# EAGLE design mouse (EAGLE 9.5.2)

## Sheet 1 of 2: Control
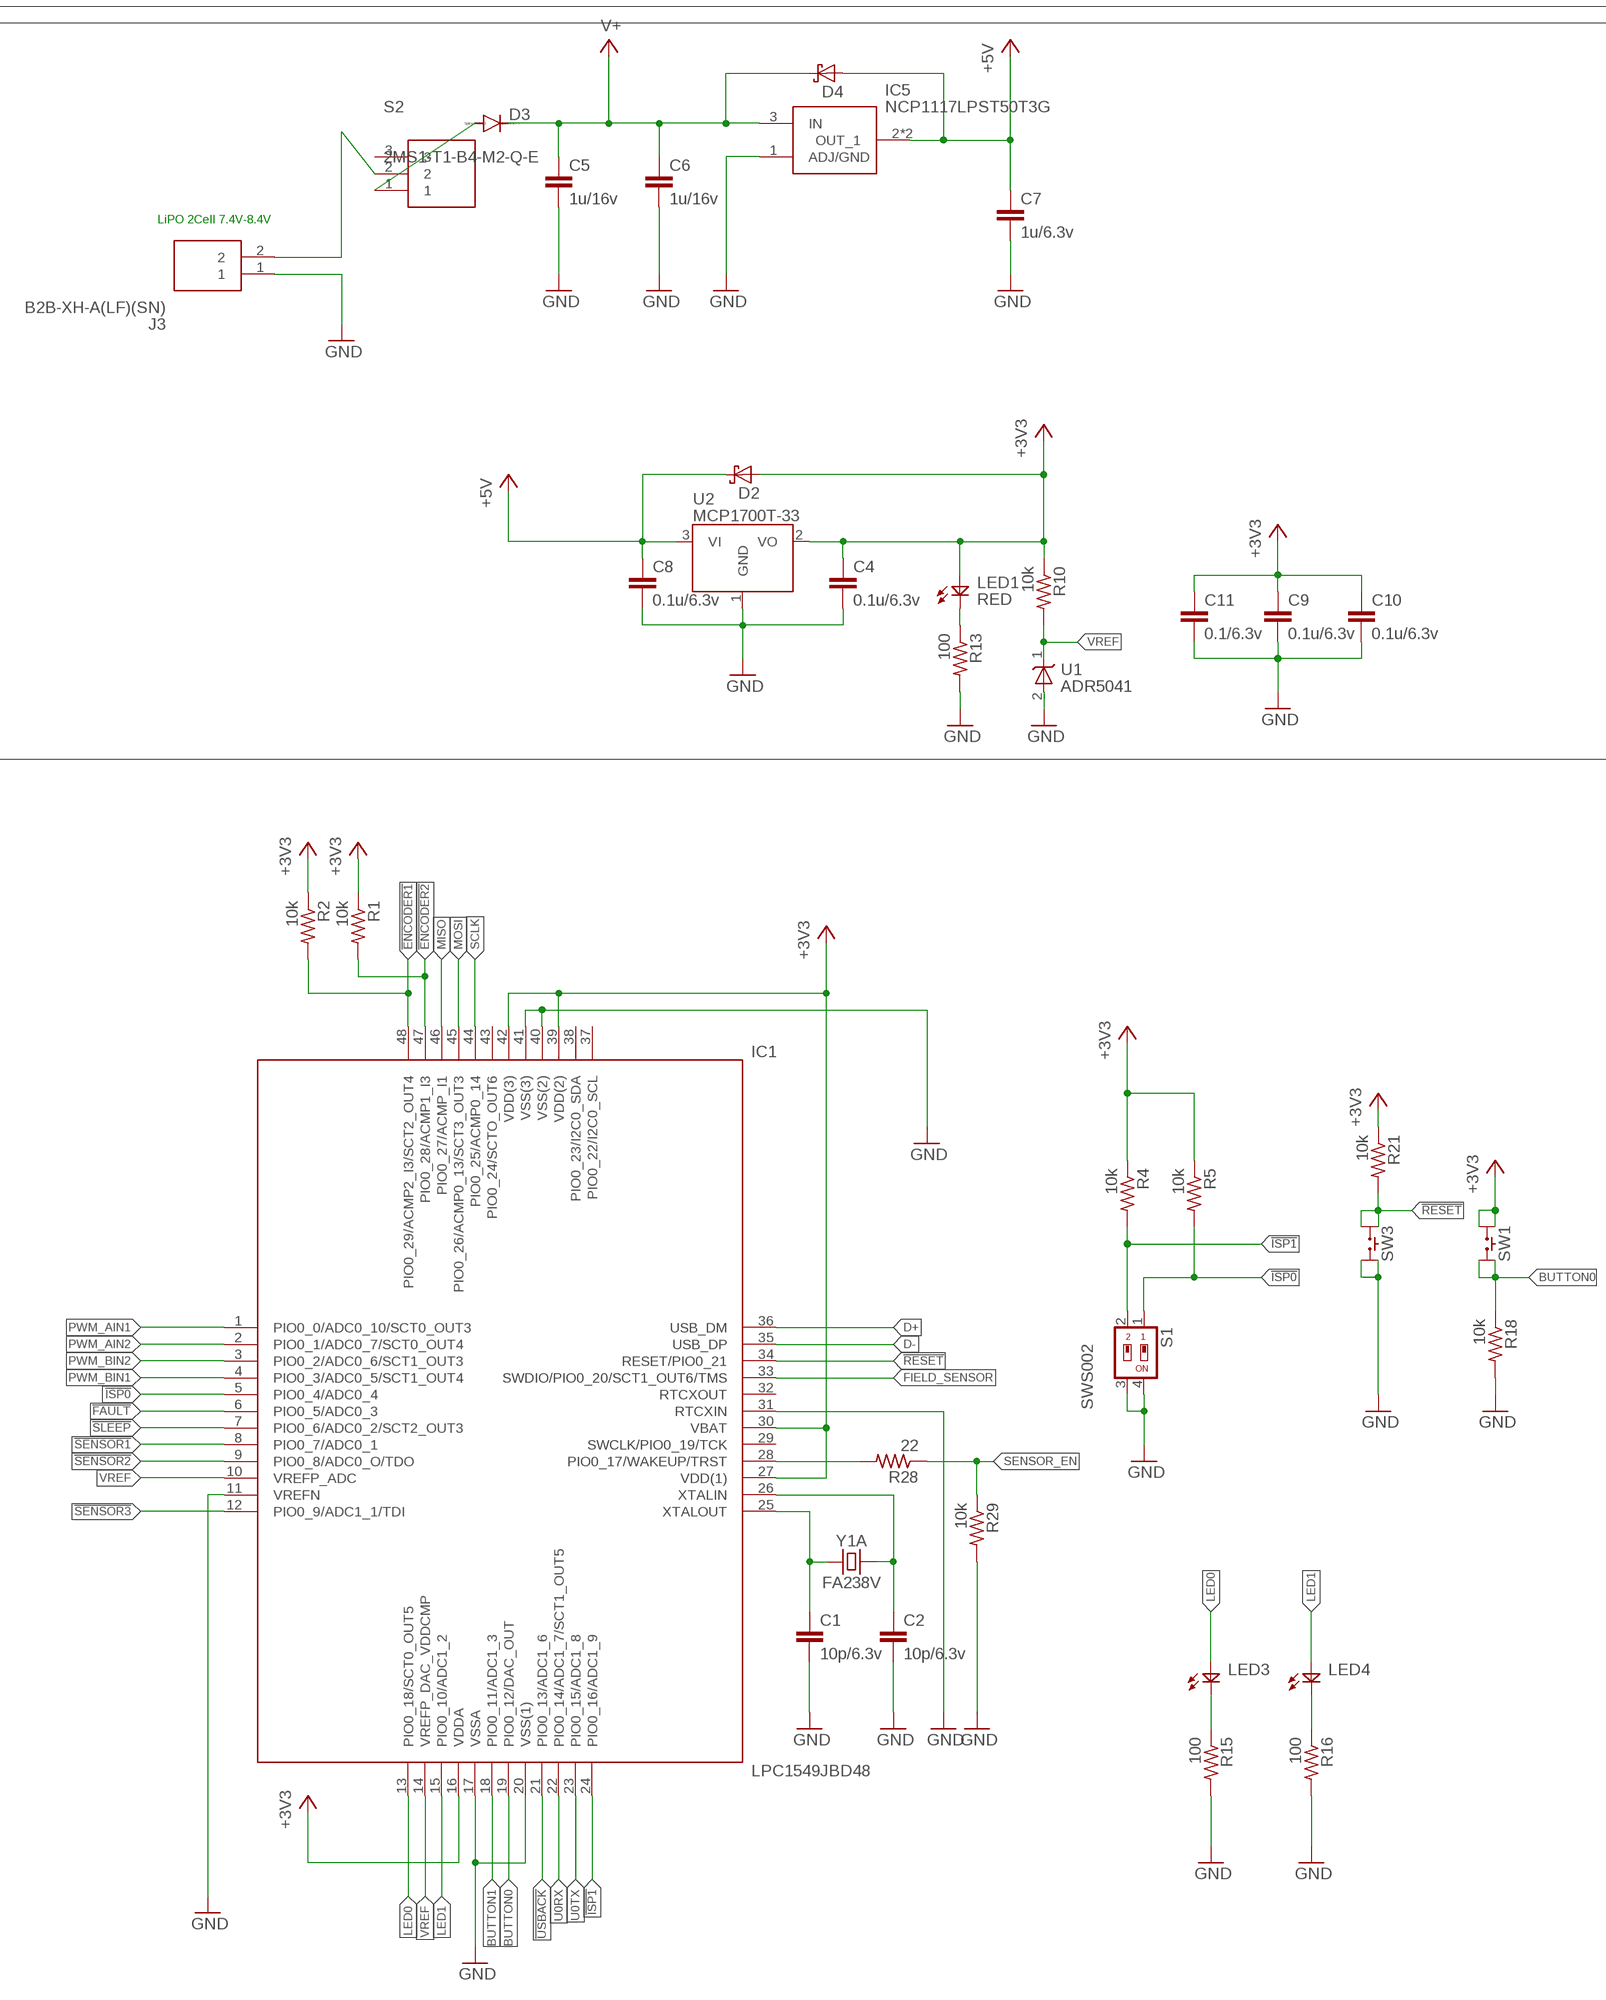
[diagram p0: schematic, sheet 1, part 1 of 2]
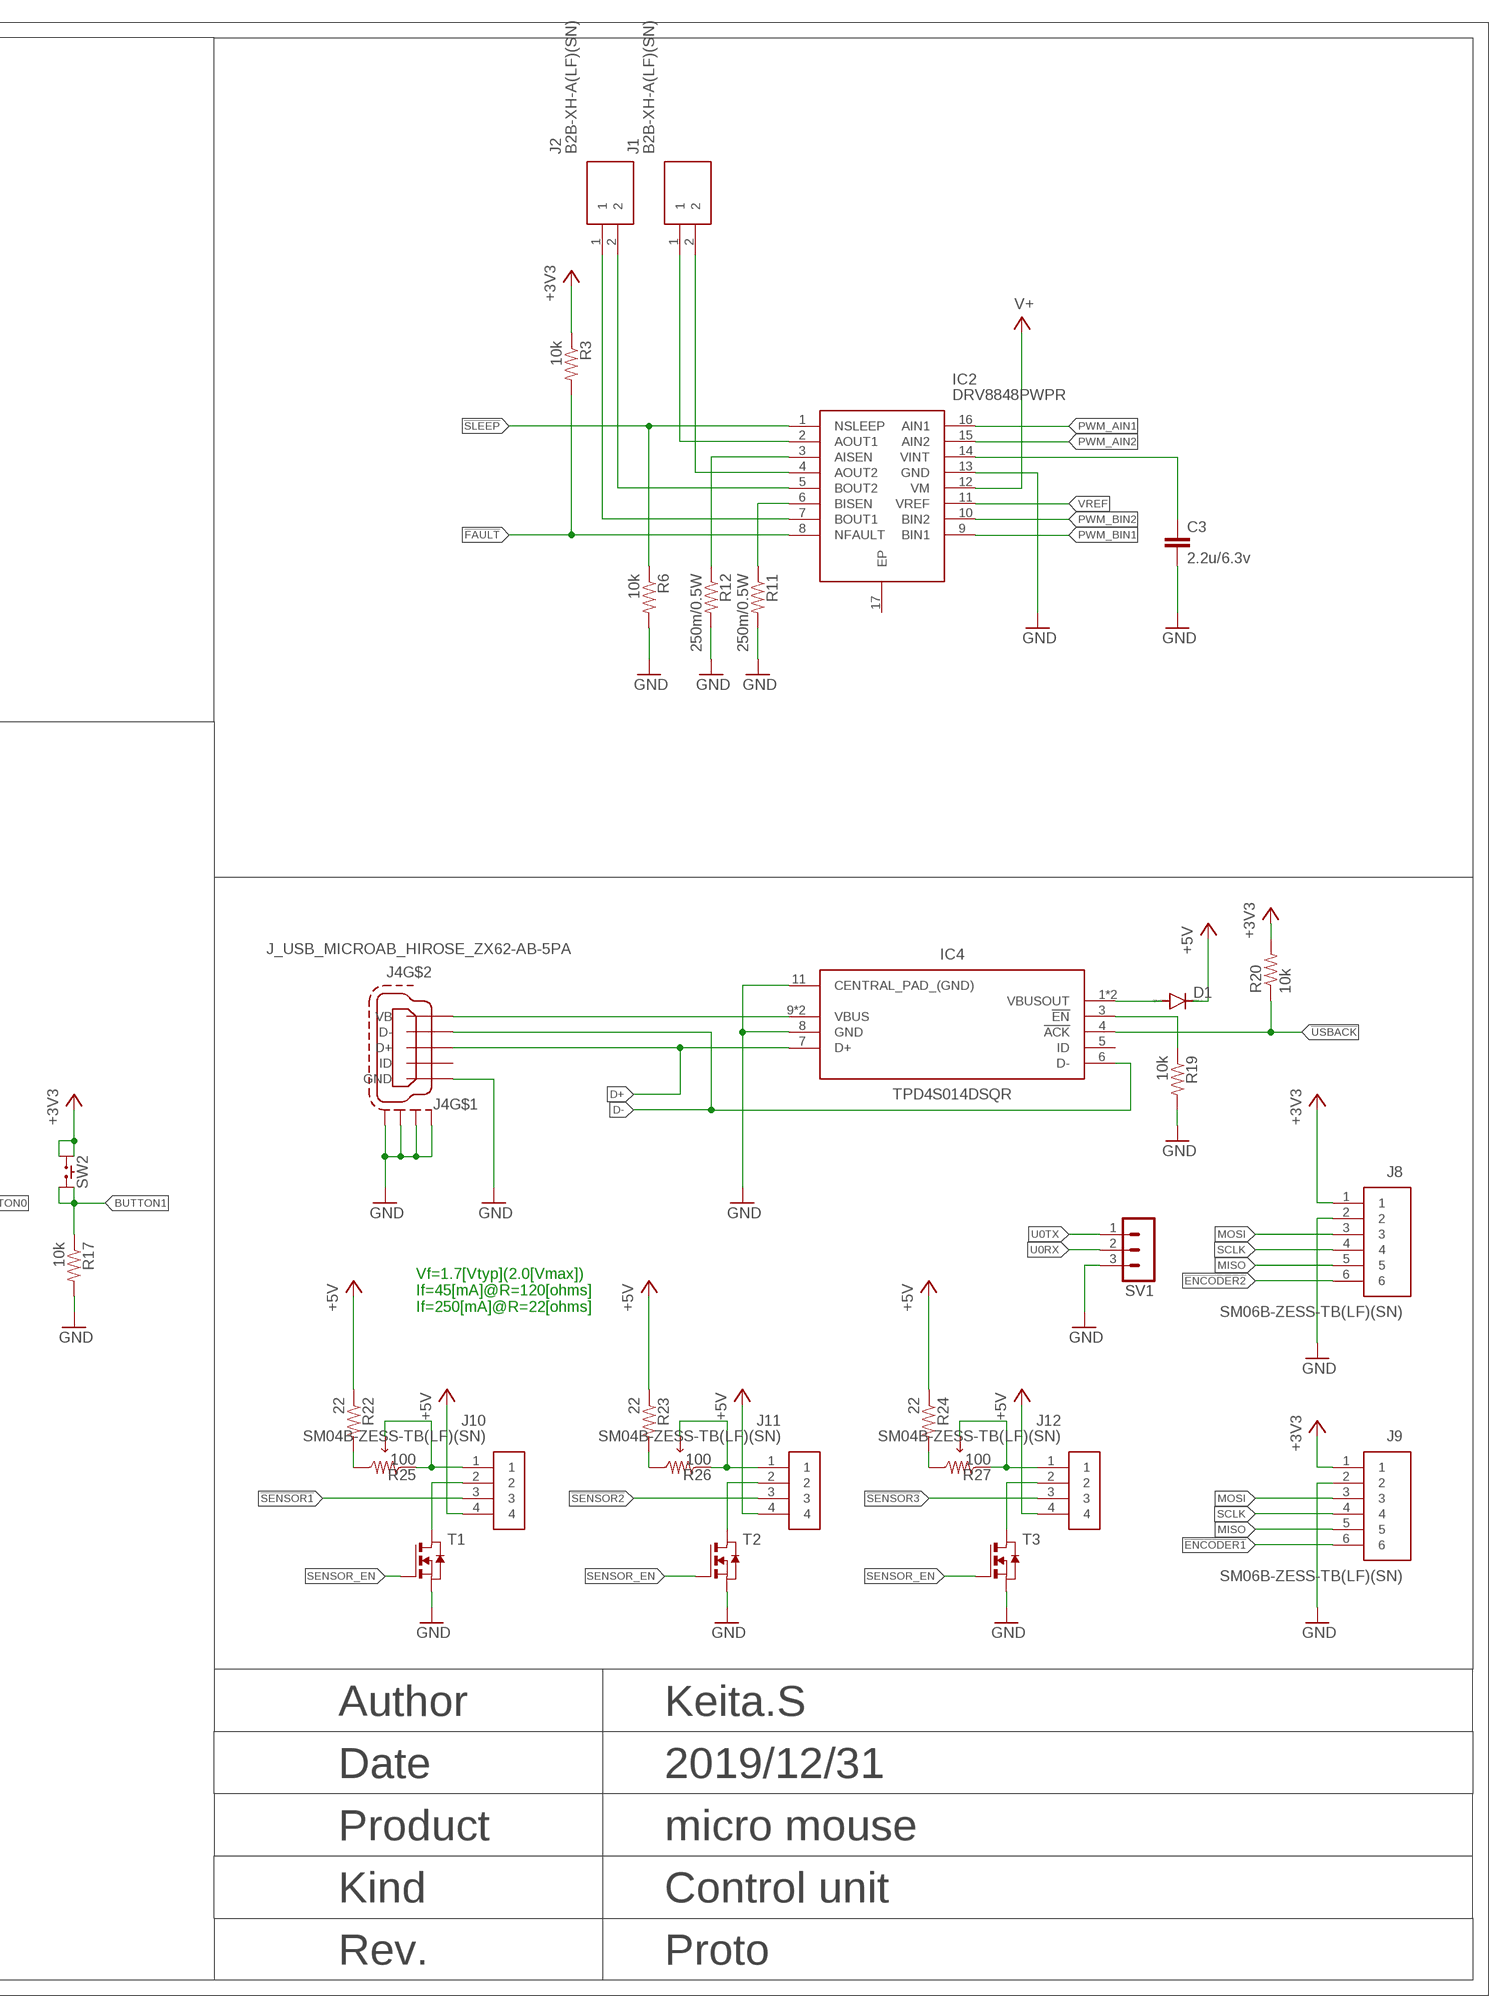
[diagram p1: schematic, sheet 1, part 2 of 2]

### Parts
C1  10p/6.3v  C-EUC0603  [C0603]
C2  10p/6.3v  C-EUC0603  [C0603]
C3  2.2u/6.3v  C-EUC0603  [C0603]
C4  0.1u/6.3v  C-EUC0603  [C0603]
C5  1u/16v  C-EUC0603  [C0603]
C6  1u/16v  C-EUC0603  [C0603]
C7  1u/6.3v  C-EUC0603  [C0603]
C8  0.1u/6.3v  C-EUC0603  [C0603]
C9  0.1u/6.3v  C-EUC0603  [C0603]
C10  0.1u/6.3v  C-EUC0603  [C0603]
C11  0.1/6.3v  C-EUC0603  [C0603]
D1  DIODE-SMB  [SMB]
D2  SBD-SOD523  [DIODE_SOD523]
D3  DIODE-SMB  [SMB]
D4  SBD-SOD523  [DIODE_SOD523]
IC1  LPC1549JBD48  [QFP50P900X900X160-48N]
IC2  DRV8848PWPR  [SOP65P640X120-17N]
IC4  TPD4S014DSQR  [SON40P200X200X80-11N]
IC5  NCP1117LPST50T3G  [SOT230P700X180-4N]
J1  B2B-XH-A(LF)(SN)  [SHDR2W64P0X250_1X2_740X575X700]
J2  B2B-XH-A(LF)(SN)  [SHDR2W64P0X250_1X2_740X575X700]
J3  B2B-XH-A(LF)(SN)  [SHDR2W64P0X250_1X2_740X575X700]
J4  J_USB_MICROAB_HIROSE_ZX62-AB-5PA  [J_USB_MICROAB_HIROSE_ZX62-AB-5PA]
J8  SM06B-ZESS-TB(LF)(SN)  [SM06BZESSTBLFSN]
J9  SM06B-ZESS-TB(LF)(SN)  [SM06BZESSTBLFSN]
J10  SM04B-ZESS-TB(LF)(SN)  [SM04BZESSTBLFSN]
J11  SM04B-ZESS-TB(LF)(SN)  [SM04BZESSTBLFSN]
J12  SM04B-ZESS-TB(LF)(SN)  [SM04BZESSTBLFSN]
LED1  RED  LED1608  [LED1608]
LED3  LED1608  [LED1608]
LED4  LED1608  [LED1608]
R1  10k  R-US_R0603  [R0603]
R2  10k  R-US_R0603  [R0603]
R3  10k  R-US_R0603  [R0603]
R4  10k  R-US_R0603  [R0603]
R5  10k  R-US_R0603  [R0603]
R6  10k  R-US_R0603  [R0603]
R10  10k  R-US_R0603  [R0603]
R11  250m/0.5W  R-US_R1206  [R1206]
R12  250m/0.5W  R-US_R1206  [R1206]
R13  100  R-US_R0603  [R0603]
R15  100  R-US_R0603  [R0603]
R16  100  R-US_R0603  [R0603]
R17  10k  R-US_R0603  [R0603]
R18  10k  R-US_R0603  [R0603]
R19  10k  R-US_R0603  [R0603]
R20  10k  R-US_R0603  [R0603]
R21  10k  R-US_R0603  [R0603]
R22  22  R-US_R0603  [R0603]
R23  22  R-US_R0603  [R0603]
R24  22  R-US_R0603  [R0603]
R25  100  CT6EP203  [CT6EP203]
R26  100  CT6EP203  [CT6EP203]
R27  100  CT6EP203  [CT6EP203]
R28  22  R-US_R0603  [R0603]
R29  10k  R-US_R0603  [R0603]
S1  SWS002  [SMS-002]
S2  2MS1-T1-B4-M2-Q-E  [2MS1-T1-B4-M2-Q-E]
SV1  MA03-1  [MA03-1]
SW1  SKRP  [SKRP]
SW2  SKRP  [SKRP]
SW3  SKRP  [SKRP]
T1  NMOSSOT23  [SOT-23]
T2  NMOSSOT23  [SOT-23]
T3  NMOSSOT23  [SOT-23]
U1  ADR5041  [SC70-3]
U2  MCP1700T-33  [SOT23-3]
Y1  FA238V  [EPSON_FA238V]

### Nets
!ENCODER1: IC1.48(PIO0_29/ACMP2_I3/SCT2_OUT4) J9.6 R2.2
!ENCODER2: IC1.47(PIO0_28/ACMP1_I3) J8.6 R1.2
!FAULT: IC1.6(PIO0_5/ADC0_3) IC2.8(NFAULT) R3.2
!ISP0: IC1.5(PIO0_4/ADC0_4) R5.2 S1.1
!ISP1: IC1.24(PIO0_16/ADC1_9) R4.2 S1.2
!RESET: IC1.34(RESET/PIO0_21) R21.2 SW3.A1 SW3.A2
!SENSOR1: IC1.8(PIO0_7/ADC0_1) J10.3
!SENSOR2: IC1.9(PIO0_8/ADC0_O/TDO) J11.3
!SENSOR3: IC1.12(PIO0_9/ADC1_1/TDI) J12.3
!SLEEP: IC1.7(PIO0_6/ADC0_2/SCT2_OUT3) IC2.1(NSLEEP) R6.1
!USBACK: IC1.21(PIO0_13/ADC1_6) IC4.4(!ACK) R20.1
+3V3: C4.1 C9.1 C10.1 C11.1 D2.A IC1.16(VDDA) IC1.27(VDD(1)) IC1.30(VBAT) IC1.39(VDD(2)) IC1.42(VDD(3)) J8.1 J9.1 LED1.A R1.1 R2.1 R3.1 R4.1 R5.1 R10.1 R20.2 R21.1 SW1.A1 SW1.A2 SW2.A1 SW2.A2 U2.2(VO)
+5V: C7.1 C8.1 D1.C D2.K D4.A IC5.2(OUT_1) IC5.4(OUT_1) J10.4 J11.4 J12.4 R22.1 R23.1 R24.1 U2.3(VI)
BUTTON0: IC1.19(PIO0_12/DAC_OUT) R18.1 SW1.B1 SW1.B2
BUTTON1: IC1.18(PIO0_11/ADC1_3) R17.1 SW2.B1 SW2.B2
D+: IC1.36(USB_DM) IC4.7(D+) J4.P$3(D+)
D-: IC1.35(USB_DP) IC4.6(D-) J4.P$2(D-)
FIELD_SENSOR: IC1.33(SWDIO/PIO0_20/SCT1_OUT6/TMS)
GND: C1.2 C2.2 C3.2 C4.2 C5.2 C6.2 C7.2 C8.2 C9.2 C10.2 C11.2 IC1.11(VREFN) IC1.17(VSSA) IC1.20(VSS(1)) IC1.31(RTCXIN) IC1.40(VSS(2)) IC1.41(VSS(3)) IC2.13(GND) IC4.8(GND) IC4.11(CENTRAL_PAD_(GND)) IC5.1(ADJ/GND) J3.1 J4.P$5(GND) J4.SHIELD1(S1) J4.SHIELD2(S2) J4.SHIELD3(S3) J4.SHIELD4(S4) J8.2 J9.2 R6.2 R11.2 R12.2 R13.2 R15.2 R16.2 R17.2 R18.2 R19.2 R29.2 S1.3 S1.4 SV1.3 SW3.B1 SW3.B2 T1.2(S) T2.2(S) T3.2(S) U1.2(A) U2.1(GND)
LED0: IC1.13(PIO0_18/SCT0_OUT5) LED3.A
LED1: IC1.15(PIO0_10/ADC1_2) LED4.A
MISO: IC1.46(PIO0_27/ACMP_I1) J8.5 J9.5
MOSI: IC1.45(PIO0_26/ACMP0_13/SCT3_OUT3) J8.3 J9.3
N$1: C1.1 IC1.25(XTALOUT) Y1.1
N$2: C2.1 IC1.26(XTALIN) Y1.3
N$3: D3.A S2.1
N$4: R22.2 R25.1(CCW)
N$5: IC2.6(BISEN) R11.1
N$6: D1.A IC4.1(VBUSOUT) IC4.2(VBUSOUT)
N$8: C3.1 IC2.14(VINT)
N$9: J3.2 S2.2
N$10: LED1.K R13.1
N$11: IC2.2(AOUT1) J1.1
N$12: IC2.4(AOUT2) J1.2
N$13: IC2.5(BOUT2) J2.2
N$14: IC2.7(BOUT1) J2.1
N$15: IC2.3(AISEN) R12.1
N$19: LED3.K R15.1
N$20: IC4.3(!EN) R19.1
N$21: LED4.K R16.1
N$22: R23.2 R26.1(CCW)
N$23: IC4.9(VBUS) IC4.10(VBUS) J4.P$1(VB)
N$24: J11.1 R26.2(WIPER) R26.3(CW)
N$25: R24.2 R27.1(CCW)
N$26: J12.1 R27.2(WIPER) R27.3(CW)
N$29: IC1.28(PIO0_17/WAKEUP/TRST) R28.2
N$30: J10.2 T1.1(D)
N$31: J10.1 R25.2(WIPER) R25.3(CW)
N$32: J11.2 T2.1(D)
N$33: J12.2 T3.1(D)
PWM_AIN1: IC1.1(PIO0_0/ADC0_10/SCT0_OUT3) IC2.16(AIN1)
PWM_AIN2: IC1.2(PIO0_1/ADC0_7/SCT0_OUT4) IC2.15(AIN2)
PWM_BIN1: IC1.4(PIO0_3/ADC0_5/SCT1_OUT4) IC2.9(BIN1)
PWM_BIN2: IC1.3(PIO0_2/ADC0_6/SCT1_OUT3) IC2.10(BIN2)
SCLK: IC1.44(PIO0_25/ACMP0_14) J8.4 J9.4
SENSOR_EN: R28.1 R29.1 T1.3(G) T2.3(G) T3.3(G)
U0RX: IC1.22(PIO0_14/ADC1_7/SCT1_OUT5) SV1.2
U0TX: IC1.23(PIO0_15/ADC1_8) SV1.1
V+: C5.1 C6.1 D3.C D4.K IC2.12(VM) IC5.3(IN)
VREF: IC1.10(VREFP_ADC) IC1.14(VREFP_DAC_VDDCMP) IC2.11(VREF) R10.2 U1.1(K)
Unconnected: IC1.29(SWCLK/PIO0_19/TCK) IC1.32(RTCXOUT) IC1.37(PIO0_22/I2C0_SCL) IC1.38(PIO0_23/I2C0_SDA) IC1.43(PIO0_24/SCTO_OUT6) IC2.17(EP) IC4.5(ID) J4.P$4(ID) S2.3 Y1.2 Y1.4

### Notes on the sheet
- LiPO 2Cell 7.4V-8.4V
- Vf=1.7[Vtyp](2.0[Vmax])
  If=45[mA]@R=120[ohms]
  If=250[mA]@R=22[ohms]
- Author | Keita.S
- Date | 2019/12/31
- Product | micro mouse
- Kind | Control unit
- Rev. | Proto

## Sheet 2 of 2

## Library data of the parts
C1-C11 = rcl:C-EU: CAPACITOR, European symbol; SPICEPREFIX: C
D1 D3 = diode:DIODE-: DIODE
D2 D4 = MotorDriver:SBD-*
IC1 = LPC1549JBD48:LPC1549JBD48: NXP - LPC1549JBD48 - 32BIT MCU, CORTEX-M3, 72 MHZ, LQFP-48 Source: Datasheet <http://www.farnell.com/datasheets/1963077.pdf>; DESCRIPTION: NXP - LPC1549JBD48 - 32BIT MCU, CORTEX-M3, 72 MHZ, LQFP-48; HEIGHT: 1.6mm; MANUFACTURER_NAME: Nexperia; MANUFACTURER_PART_NUMBER: LPC1549JBD48; SUPPLIER_NAME: RS
IC2 = DRV8848PWPR:DRV8848PWPR: Motor / Motion / Ignition Controllers & Drivers 2A Dual H-Bridge 16-HTSSOP -40 to 85 Source: Datasheet <http://www.ti.com/lit/ds/symlink/drv8848.pdf>; DESCRIPTION: Motor / Motion / Ignition Controllers & Drivers 2A Dual H-Bridge 16-HTSSOP -40 to 85; HEIGHT: 1.2mm; MANUFACTURER_NAME: Texas Instruments; MANUFACTURER_PART_NUMBER: DRV8848PWPR
IC4 = TPD4S014DSQR:TPD4S014DSQR: Texas Instruments TPD4S014DSQR, USB Controller, 480Mbit/s, USB 2.0, 10-Pin SON <https://componentsearchengine.com/Images/3/TPD4S014DSQR.jpg> Source: Datasheet <http://www.ti.com/lit/gpn/tpd4s014>; DESCRIPTION: Texas Instruments TPD4S014DSQR, USB Controller, 480Mbit/s, USB 2.0, 10-Pin SON; HEIGHT: 0.8mm; MANUFACTURER_NAME: Texas Instruments; MANUFACTURER_PART_NUMBER: TPD4S014DSQR; RS_PART_NUMBER: 7422968; SUPPLIER_NAME: RS
IC5 = NCP1117LPST50T3G:NCP1117LPST50T3G: Source: Datasheet <http://uk.rs-online.com/web/p/products/7857187P>; ALLIED_NUMBER: 70340553; HEIGHT: 1.8mm; MANUFACTURER_NAME: ON Semiconductor; MANUFACTURER_PART_NUMBER: NCP1117LPST50T3G; RS_PART_NUMBER: 7857187P; RS_PRICE-STOCK: http://uk.rs-online.com/web/p/products/7857187P
J1-J3 = B2B-XH-A(LF)(SN):B2B-XH-A(LF)(SN): JST XH Series, 2.5mm Pitch 2 Way 1 Row Straight PCB Header, Solder Termination, 3A Source: Datasheet <http://uk.rs-online.com/web/p/products/8201554P>; DESCRIPTION: JST XH Series, 2.5mm Pitch 2 Way 1 Row Straight PCB Header, Solder Termination, 3A; HEIGHT: 7mm; MANUFACTURER_NAME: JST (JAPAN SOLDERLESS TERMINALS); MANUFACTURER_PART_NUMBER: B2B-XH-A(LF)(SN); RS_PART_NUMBER: 8201554P; RS_PRICE-STOCK: http://uk.rs-online.com/web/p/products/8201554P
J4 = j_usb_hirose_zx62-ab-5pa:J_USB_MICROAB_HIROSE_ZX62-AB-5PA: USB Micro-AB SMT connector Hirose Electric Co Ltd: ZX62-AB-5P
J8 J9 = SM06B-ZESS-TB(LF)(SN):SM06B-ZESS-TB(LF)(SN): Wire-To-Board Connector, ZE Series, Surface Mount, Header, 6, 1.5 mm, Tin Plated Contacts RoHS Compliant: Yes Source: Datasheet <https://componentsearchengine.com/Datasheets/2/SM06B-ZESS-TB(LF)(SN).pdf>; DESCRIPTION: Wire-To-Board Connector, ZE Series, Surface Mount, Header, 6, 1.5 mm, Tin Plated Contacts RoHS Compliant: Yes; HEIGHT: 5.8mm; MANUFACTURER_NAME: JST (JAPAN SOLDERLESS TERMINALS); MANUFACTURER_PART_NUMBER: SM06B-ZESS-TB(LF)(SN)
J10-J12 = SM04B-ZESS-TB(LF)(SN):SM04B-ZESS-TB(LF)(SN): JST (JAPAN SOLDERLESS TERMINALS) - SM04B-ZESS-TB(LF)(SN) - CONNECTOR, HEADER, 4POS, 1ROW, 1.5MM Source: Datasheet <http://www.jst-mfg.com/product/pdf/eng/eZE.pdf>; DESCRIPTION: JST (JAPAN SOLDERLESS TERMINALS) - SM04B-ZESS-TB(LF)(SN) - CONNECTOR, HEADER, 4POS, 1ROW, 1.5MM; HEIGHT: 5mm; MANUFACTURER_NAME: JST (JAPAN SOLDERLESS TERMINALS); MANUFACTURER_PART_NUMBER: SM04B-ZESS-TB(LF)(SN)
LED1 LED3 LED4 = MotorDriver:LED
R1-R6 R10-R13 R15-R24 R28 R29 = rcl:R-US_: RESISTOR, American symbol; SPICEPREFIX: R
R25-R27 = CT6EP203:CT6EP203: TRIMMER 20K OHM 0.5W PC PIN TOP Source: Datasheet <https://www.nidec-copal-electronics.com/e/catalog/trimmer/ct-6.pdf>; DESCRIPTION: TRIMMER 20K OHM 0.5W PC PIN TOP; HEIGHT: 6.1mm; MANUFACTURER_NAME: Copal Electronics; MANUFACTURER_PART_NUMBER: CT6EP203
S1 = smd-special:SWS002: SMD Dip Switch 2 pol.
S2 = 2MS1-T1-B4-M2-Q-E:2MS1-T1-B4-M2-Q-E: Sub-miniature toggle switch Source: Datasheet <http://akizukidenshi.com/download/2MS1-T1-B4-M2-Q-E-S.pdf>; DESCRIPTION: Sub-miniature toggle switch; HEIGHT: mm; MANUFACTURER_NAME: Cosland; MANUFACTURER_PART_NUMBER: 2MS1-T1-B4-M2-Q-E
SV1 = con-lstb:MA03-1: PIN HEADER; OC_FARNELL: unknown; OC_NEWARK: unknown
SW1-SW3 = MotorDriver:SKRP
T1-T3 = zetex:NMOSSOT23: MOS FET; OC_FARNELL: unknown; OC_NEWARK: unknown
U1 = MotorDriver:ADR504*
U2 = MotorDriver:MCP1700T-*
Y1 = FA238V:FA238V: MHz RANGE CRYSTAL UNIT Source: Datasheet <https://support.epson.biz/td/api/doc_check.php?mode=dl&lang=en&Parts=FA-238V>; DESCRIPTION: MHz RANGE CRYSTAL UNIT; HEIGHT: mm; MANUFACTURER_NAME: Epson ICs; MANUFACTURER_PART_NUMBER: FA238V; SUPPLIER_NAME: RS

## Board
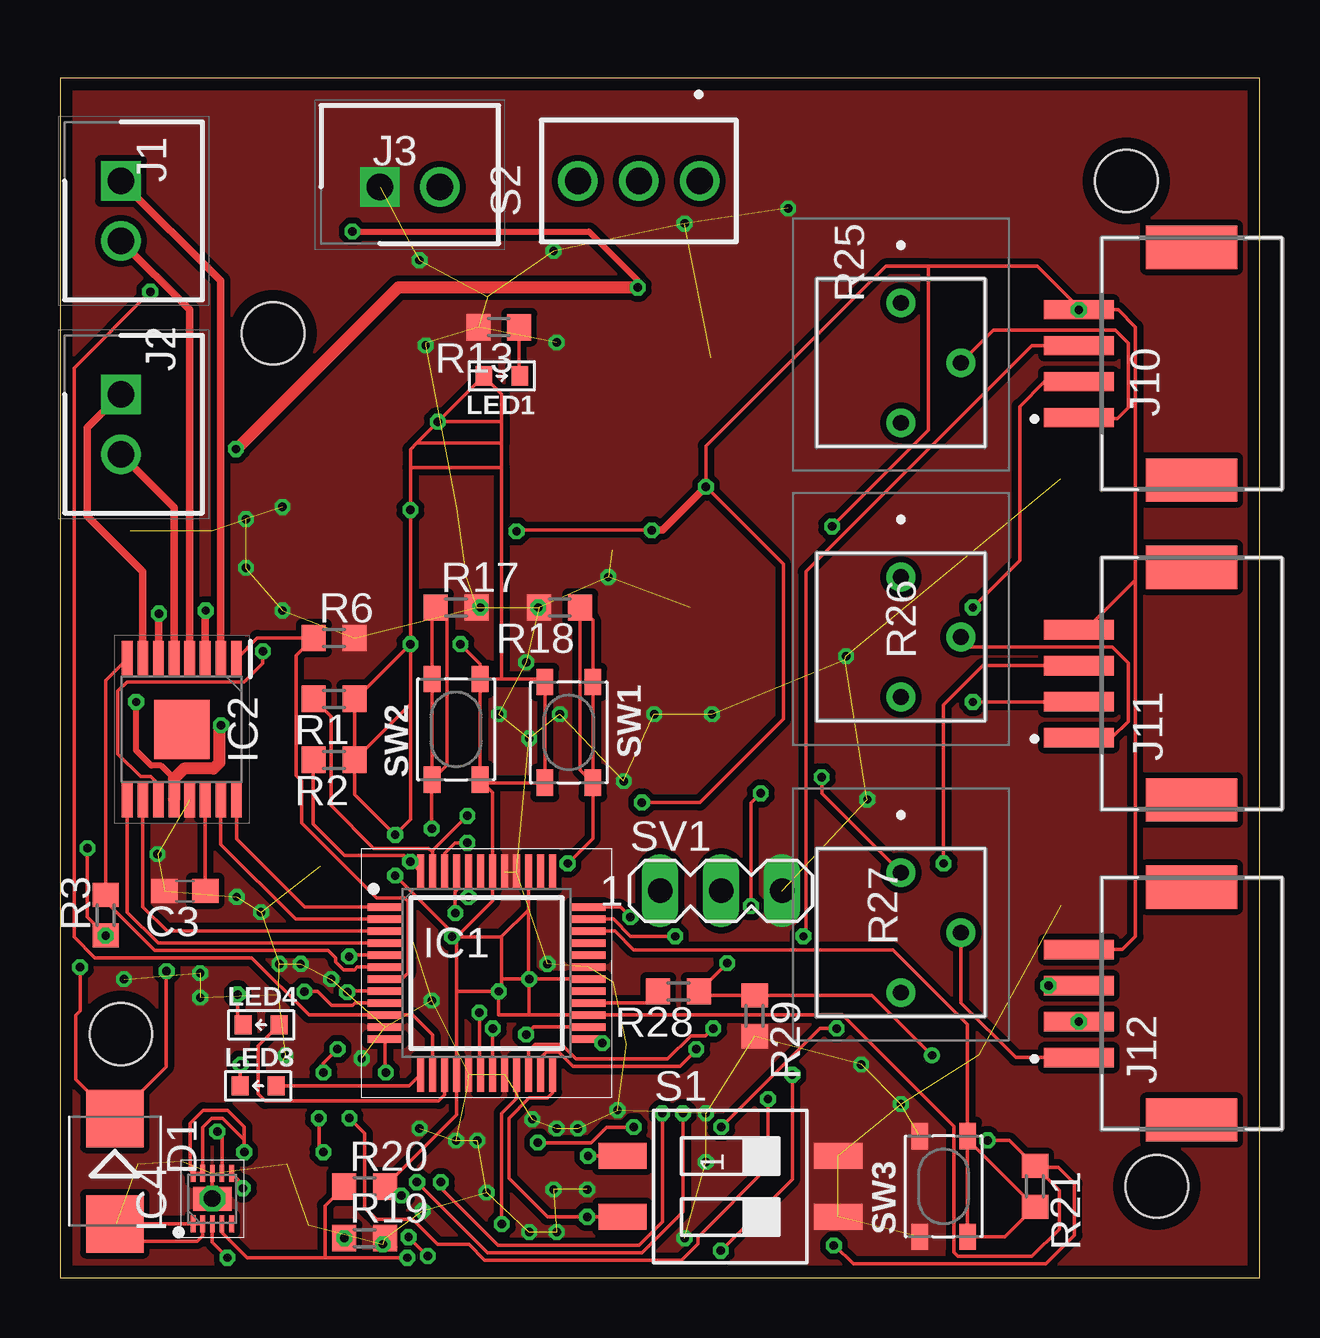
[diagram p2: board, top side]
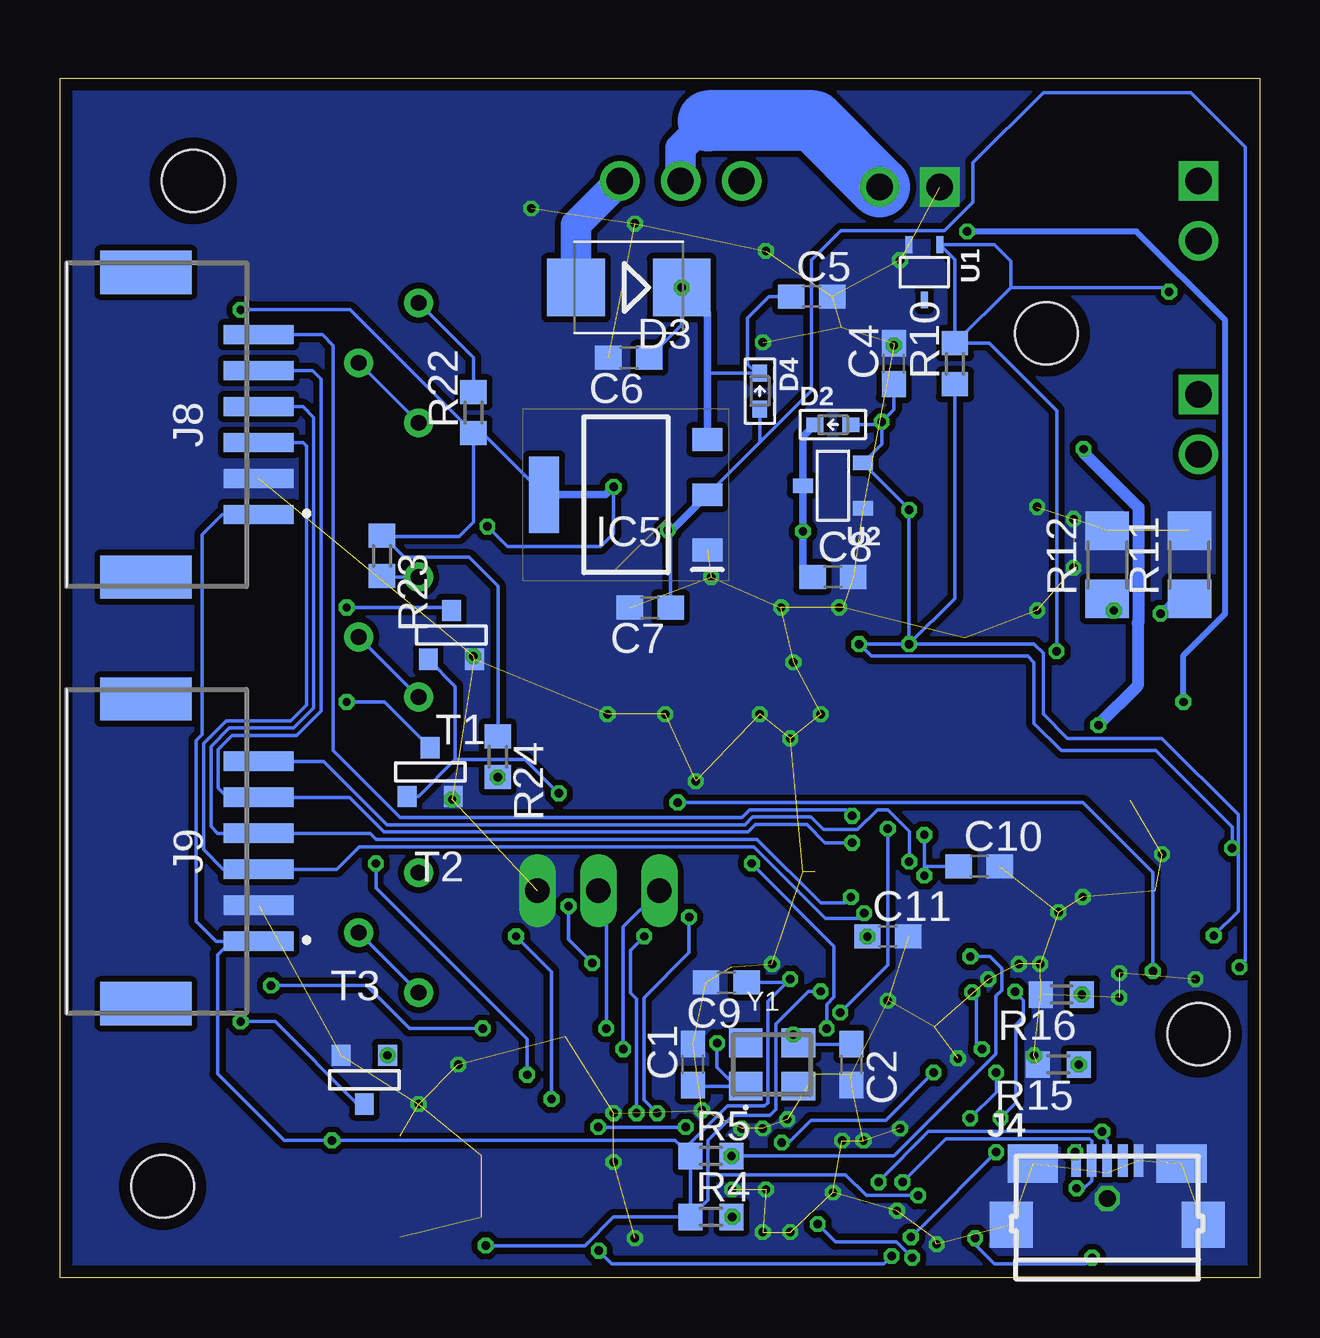
[diagram p3: board, bottom side, seen from below]

Size 50 x 50 mm. Coordinates in mm from the lower left corner, seen from the top.
Outline: 0,0 50,0 50,50 0,50 0,0
Copper layers (1*16): Top 0.035mm / dielectric 1.6mm / Bottom 0.035mm
Design rules "Elecrow_2-layer_PCB_eagle_rule": minimum track width 6mil, minimum drill 12mil, track to track 6mil, track to pad 6mil, pad to pad 6mil, via to via 8mil, smd to smd 0mil, copper to edge 20mil, drill to drill 10mil, minimum pad ring 6mil, minimum via ring 6mil, stop-mask expansion 0mil, vias tented up to drill 100mil, thermal gap 10mil
Holes 2.6 mm at 44.45,45.72 45.72,3.81 8.89,39.37 2.54,10.16

### Footprints (pad centres in the part's own frame; a part is rotated, then mirrored left to right if it is on the bottom)
C0603 = smd 1.1 x 1: 1 -0.85,0; 2 0.85,0
SMB = smd 2.4 x 2.4: A 2.2,0; C -2.2,0
DIODE_SOD523 = smd 0.7 x 0.6: A 0.75,0; K -0.75,0
QFP50P900X900X160-48N = smd 1.45 x 0.3: 1 -4.225,2.75; 2 -4.225,2.25; 3 -4.225,1.75; 4 -4.225,1.25; 5 -4.225,0.75; 6 -4.225,0.25; 7 -4.225,-0.25; 8 -4.225,-0.75; 9 -4.225,-1.25; 10 -4.225,-1.75; 11 -4.225,-2.25; 12 -4.225,-2.75; 25 4.225,-2.75; 26 4.225,-2.25; 27 4.225,-1.75; 28 4.225,-1.25; 29 4.225,-0.75; 30 4.225,-0.25; 31 4.225,0.25; 32 4.225,0.75; 33 4.225,1.25; 34 4.225,1.75; 35 4.225,2.25; 36 4.225,2.75 | smd 0.3 x 1.45: 13 -2.75,-4.225; 14 -2.25,-4.225; 15 -1.75,-4.225; 16 -1.25,-4.225; 17 -0.75,-4.225; 18 -0.25,-4.225; 19 0.25,-4.225; 20 0.75,-4.225; 21 1.25,-4.225; 22 1.75,-4.225; 23 2.25,-4.225; 24 2.75,-4.225; 37 2.75,4.225; 38 2.25,4.225; 39 1.75,4.225; 40 1.25,4.225; 41 0.75,4.225; 42 0.25,4.225; 43 -0.25,4.225; 44 -0.75,4.225; 45 -1.25,4.225; 46 -1.75,4.225; 47 -2.25,4.225; 48 -2.75,4.225
SOP65P640X120-17N = smd 1.475 x 0.45: 1 -2.938,2.275; 2 -2.938,1.625; 3 -2.938,0.975; 4 -2.938,0.325; 5 -2.938,-0.325; 6 -2.938,-0.975; 7 -2.938,-1.625; 8 -2.938,-2.275; 9 2.938,-2.275; 10 2.938,-1.625; 11 2.938,-0.975; 12 2.938,-0.325; 13 2.938,0.325; 14 2.938,0.975; 15 2.938,1.625; 16 2.938,2.275 | smd 2.46 x 2.31: 17 0,0
SON40P200X200X80-11N = smd 0.7 x 0.2: 1 -1.05,0.8; 2 -1.05,0.4; 3 -1.05,0; 4 -1.05,-0.4; 5 -1.05,-0.8; 6 1.05,-0.8; 7 1.05,-0.4; 8 1.05,0; 9 1.05,0.4; 10 1.05,0.8 | smd 1 x 1.6: 11 0,0
SOT230P700X180-4N = smd 1.25 x 0.95: 1 -3.4,2.3; 2 -3.4,0; 3 -3.4,-2.3 | smd 1.25 x 3.2: 4 3.4,0
SHDR2W64P0X250_1X2_740X575X700 = drill 1.1 pad 1.65 square: 1 0,0 | drill 1.1 pad 1.65: 2 2.5,0
J_USB_MICROAB_HIROSE_ZX62-AB-5PA = smd 0.4 x 1.35: P$1 -1.3,4.125; P$2 -0.65,4.125; P$3 0,4.125; P$4 0.65,4.125; P$5 1.3,4.125 | smd 1.8 x 1.9: SHIELD1 -4,1.45; SHIELD4 4,1.45 | smd 2.1 x 1.6: SHIELD2 -3.1,4; SHIELD3 3.1,4
SM06BZESSTBLFSN = smd 0.8 x 2.9: 1 3.75,4; 2 2.25,4; 3 0.75,4; 4 -0.75,4; 5 -2.25,4; 6 -3.75,4 | smd 1.8 x 3.8: MP1 -6.35,-0.7; MP2 6.35,-0.7
SM04BZESSTBLFSN = smd 0.8 x 2.9: 1 -2.25,3.25; 2 -0.75,3.25; 3 0.75,3.25; 4 2.25,3.25 | smd 1.8 x 3.8: 5 -4.85,-1.45; 6 4.85,-1.45
LED1608 = smd 0.7 x 0.8: A 0.75,0; K -0.75,0
R0603 = smd 1 x 1.1: 1 -0.85,0; 2 0.85,0
R1206 = smd 1.6 x 1.803: 1 -1.422,0; 2 1.422,0
CT6EP203 = drill 0.65 pad 1.192: 1 0,0; 2 2.5,2.5; 3 5,0
SMS-002 = smd 1.092 x 2.007: 1 -1.27,-4.496; 2 1.27,-4.496; 3 1.27,4.496; 4 -1.27,4.496
2MS1-T1-B4-M2-Q-E = drill 1.09 pad 1.65: 1 0,-2.54; 2 0,0; 3 0,2.54
MA03-1 = drill 1.016 long: 1 -2.54,0; 2 0,0; 3 2.54,0
SKRP = smd 1.1 x 0.7: A1 -2.1,-1; A2 2.1,-1; B1 -2.1,1; B2 2.1,1
SOT-23 = smd 0.787 x 0.889: 1 0.025,-1.016; 2 -0.94,1.016; 3 0.991,1.016
SC70-3 = smd 0.3 x 0.7: 1 -0.65,-1.15; 2 0.65,-1.15; 3 0,1.15
SOT23-3 = smd 0.6 x 0.85: 1 -0.95,-1.25; 2 0.95,-1.25; 3 0,1.25
EPSON_FA238V = smd 1.4 x 1.2: 1 -1.1,-0.9; 2 1.1,-0.9; 3 1.1,0.9; 4 -1.1,0.9

### Placement (x,y rotation side)
C1  23.62,8.89 90 bottom
C2  17.02,8.89 270 bottom
C3  5.21,16.13 180 top
C4  15.24,38.1 90 bottom
C5  18.67,40.89 0 bottom
C6  26.29,38.35 180 bottom
C7  25.4,27.94 180 bottom
C8  17.78,29.21 0 bottom
C9  22.23,12.32 180 bottom
C10  11.68,17.14 0 bottom
C11  15.49,14.22 0 bottom
D1  2.29,4.45 270 top
D2  17.78,35.56 0 bottom
D3  26.29,41.27 180 bottom
D4  20.83,36.96 270 bottom
IC1  17.78,12.7 0 top
IC2  5.08,22.86 270 top
IC4  6.35,3.3 90 top
IC5  26.42,32.64 180 bottom
J1  2.54,45.72 270 top
J2  2.54,36.83 270 top
J3  13.34,45.47 0 top
J4  6.35,0.76 0 bottom
J8  45.72,35.56 270 bottom
J9  45.72,17.78 270 bottom
J10  45.72,38.1 90 top
J11  45.72,24.77 90 top
J12  45.72,11.43 90 top
LED1  18.41,37.59 180 top
LED3  8.26,8 0 top
LED4  8.38,10.54 0 top
R1  11.43,24.13 180 top
R2  11.43,21.59 180 top
R3  1.91,15.11 90 top
R4  22.86,2.54 0 bottom
R5  22.86,5.08 0 bottom
R6  11.43,26.67 0 top
R10  12.7,38.1 90 bottom
R11  2.92,29.72 90 bottom
R12  6.35,29.72 90 bottom
R13  18.29,39.62 180 top
R15  8.38,8.89 180 bottom
R16  8.26,11.81 180 bottom
R17  16.51,27.94 0 top
R18  20.83,27.94 180 top
R19  12.7,1.65 0 top
R20  12.7,3.81 0 top
R21  40.64,3.81 270 top
R22  32.77,36.07 90 bottom
R23  36.58,30.1 270 bottom
R24  31.75,21.72 270 bottom
R25  35.05,40.64 270 top
R26  35.05,29.21 270 top
R27  35.05,16.89 270 top
R28  25.78,11.94 180 top
R29  28.96,10.92 270 top
S1  27.94,3.81 270 top
S2  24.13,45.72 90 top
SV1  27.56,16.13 0 top
SW1  21.21,22.73 270 top
SW2  16.51,22.86 90 top
SW3  36.83,3.81 90 top
T1  33.66,26.8 180 bottom
T2  34.54,21.08 180 bottom
T3  37.34,8.26 0 bottom
U1  13.97,41.91 180 bottom
U2  17.78,33.02 90 bottom
Y1  20.32,8.89 0 bottom

### Tracks (layer width: path | path; a pad name or v marks a point on that pad's centre or on a via)
!ENCODER1  (via drill 0.35)
  Top 0.152: R2.2 10.54,21.55 10.54,18.93 11.87,17.6 14.35,17.6 IC1.48 v14.6,17.35
  Bottom 0.152: v14.6,17.35 14.6,18.61 15.49,19.51 15.94,19.51 16.76,18.69 18.18,18.69 18.69,19.2 21.13,19.2 21.45,18.88 36.36,18.88 39.01,21.53 J9.6
!ENCODER2  (via drill 0.35)
  Top 0.152: R1.2 11.3,23.41 11.3,22.24 11.31,22.23 11.31,19.68 13.08,17.91 15.37,17.91 15.53,17.74 IC1.47 15.53,17.81 v16.97,19.26
  Bottom 0.152: J8.6 39.06,39.31 38.61,38.86 38.61,21.97 35.83,19.19 21.58,19.19 21.26,19.51 17.23,19.51 v16.97,19.26
!FAULT
  Top 0.152: IC2.8 1.91,24.9 R3.2 1.91,15.7 3.96,13.64 11.19,13.64 11.5,13.34 11.5,13.16 11.82,12.84 12.28,12.84 12.39,12.95 IC1.6
!ISP0  (via drill 0.35)
  Top 0.152: R5.2 S1.1 | v12.05,13.39 12.11,13.45 IC1.5
  Bottom 0.152: R5.2 15.24,5.08 10.99,9.34 10.99,11.75 10.75,11.99 10.75,12.91 11.23,13.39 v12.05,13.39
  other vias: 22.01,5.08
!ISP1  (via drill 0.35)
  Top 0.152: S1.2 v21.97,2.54 20.32,2.54 18.72,4.14 18.72,6.66 19.56,7.49 20.32,7.49 20.53,7.7 IC1.24
  Bottom 0.152: R4.2 v21.97,2.54
!RESET
  Top 0.152: 37.83,5.77 R21.2 39.39,1.71 SW3.A1 37.83,5.77 | 37.83,5.77 SW3.A2 37.83,10.56 34.71,13.68 23.92,13.68 23.14,14.45 IC1.34
!SENSOR1  (via drill 0.35)
  Top 0.152: IC1.8 12.02,11.95 v11.97,11.9 | v11.57,9.54 10.98,8.95 v10.98,8.56 | v12.06,6.65 12.7,6.02 12.7,2.92 13.19,2.43 14.69,2.43 15.73,1.39 17.04,1.39 17.7,0.74 25.91,0.74 26.59,1.42 26.59,1.7 29.51,4.62 v29.51,7.45 | J10.3 40.5,38.85 31.09,29.44 31.09,17.3 31.09,14.33 v30.99,14.23
  Bottom 0.152: v11.97,11.9 11.81,11.74 11.81,9.78 v11.57,9.54 | v10.98,8.56 10.98,7.74 v12.06,6.65 | v30.99,14.23 29.51,12.76 v29.51,7.45
!SENSOR2  (via drill 0.35)
  Top 0.152: IC1.9 12.31,11.45 12.2,11.35 11.32,11.35 10.73,11.93 v10.19,11.93 | v10.79,6.65 10.79,5.42 v10.98,5.24 | v14.53,1.69 15.32,0.91 v15.34,0.91 | v27.55,1.13 30.53,4.11 v30.53,8.46 | J11.3 38.47,25.52 36.83,23.88 v36.83,17.27
  Bottom 0.152: v10.19,11.93 9.83,11.57 9.83,10.87 10.16,10.54 10.16,7.29 v10.79,6.65 | v10.98,5.24 14.14,2.07 14.15,2.07 v14.53,1.69 | v15.34,0.91 15.66,0.58 27,0.58 v27.55,1.13 | v30.53,8.46 30.53,9.95 36.83,16.26 v36.83,17.27
!SENSOR3  (via drill 0.35)
  Top 0.152: IC1.12 13.55,8.59 v13.59,8.56 | v19.92,5.64 22.13,5.64 22.77,6.28 v23.92,6.28 | v27.56,6.28 31.67,10.39 v32.38,10.39 | J12.3 v41.2,12.18
  Bottom 0.152: v13.59,8.56 15.57,6.57 18.7,6.57 19.64,5.64 v19.92,5.64 | v23.92,6.28 v27.56,6.28 | v32.38,10.39 35.43,10.39 37.22,12.18 v41.2,12.18
!SLEEP
  Top 0.152: IC2.1 8.23,26.67 R6.1 9.85,25.94 9.85,20.95 10.08,20.72 10.08,18.96 13.21,15.83 14.38,15.83 14.51,15.7 14.51,12.71 14.25,12.45 IC1.7
!USBACK  (via drill 0.35)
  Top 0.152: IC4.4 6.75,1.88 7.79,0.83 11.05,0.83 | v14.48,0.83 11.05,0.83 | R20.1 11.05,3.01 11.05,0.83 | IC1.21 19.03,7.47 18.41,6.86 v18.41,2.24
  Bottom 0.152: v18.41,2.24 17.68,1.5 15.14,1.5 v14.48,0.83
+3V3  (via drill 0.35)
  Top 0.152: 17.64,20.63 20.07,20.63 | 20.07,20.63 SW1.A2 | SW2.A2 18.41,24.96 | 18.41,24.96 20.08,24.96 SW1.A1 20.21,20.78 20.07,20.63 | SW2.A2 SW2.A1 17.64,20.63 | 18.41,35.69 18.41,36.84 LED1.A 14.87,34.8 | 18.41,35.69 18.41,34.8 | 18.41,33.78 18.41,34.8 | 18.41,33.78 18.41,24.96 | 14.87,34.8 14.61,34.53 14.61,33.78 | 14.61,33.78 v14.61,32 v14.61,26.42 | v14.61,26.42 12.32,24.13 R1.1 R2.1 | R2.1 14.61,23.91 | v14.61,26.42 14.61,23.91 | v16.68,26.42 17.51,25.59 SW2.A2 | 18.41,33.78 14.61,33.78 | 18.41,34.8 14.87,34.8 | 18.41,35.69 v15.75,35.69 | v1.14,17.91 1.14,16.57 1.13,16.56 1.13,15.04 R3.1 | 16.53,11.94 IC1.16 16.53,6.79 R20.2 13.93,3.43 v14.22,3.43 | 16.53,11.94 16.53,14.2 | R2.1 12.28,20.15 v13.97,18.46 14.61,19.1 14.61,23.91 | 16.51,14.22 v13.97,16.76 | 16.53,14.2 18.03,15.7 IC1.42 18.03,20.24 17.64,20.63 | IC1.39 19.53,15.34 | 18.39,14.2 19.53,15.34 | 18.39,14.2 18.41,14.2 18.41,12.45 | 18.39,14.2 16.53,14.2 | IC1.30 v19.56,12.45 | v19.56,12.45 18.41,12.45 | 19.53,15.34 19.53,12.48 v19.56,12.45 | 19.56,10.95 IC1.27 32.61,10.95 37.25,6.31 37.25,1.06 37.43,0.89 40.51,0.89 41.66,2.03 41.66,3.64 40.68,4.62 | v19.56,12.45 19.56,10.95 | v18.29,11.94 16.53,11.94 | 19.56,10.95 18.29,10.95 v18.29,11.94 | 40.68,4.62 R21.1 39.57,5.73 v38.66,5.73 | 40.68,4.62 41.61,4.62 42.29,3.94 42.29,1.78 41.1,0.58 33.07,0.58 32.31,1.34 v32.26,1.34 | 18.41,12.45 18.41,12.06 v18.29,11.94 | C11.1 16.51,14.22 | 16.51,14.22 16.53,14.2
  Bottom 0.152: v14.61,26.42 v16.68,26.42 16.18,25.91 9.65,25.91 9.4,25.65 9.4,23.11 8.26,21.97 4.32,21.97 1.14,18.79 v1.14,17.91 | R10.1 12.7,28.32 v14.61,26.42 | v14.61,26.42 9.4,26.42 9.02,26.04 9.02,23.5 8,22.48 4.06,22.48 0.89,19.3 0.89,15.28 R3.1 | v13.97,16.76 13.97,17.14 | 13.97,17.14 v13.97,18.46 | R5.1 R4.1 | R4.1 22.99,3.26 22.99,4.3 | R5.1 23.71,5.63 22.18,7.16 20.62,7.16 20.49,7.29 20.49,11.52 v19.56,12.45 19.69,12.32 C9.1 | v18.29,11.94 18.8,11.94 20.15,10.59 20.15,7.03 20.4,6.78 21.95,6.78 22.99,5.73 22.99,4.3 | R5.1 24.36,5.73 v38.66,5.73 40.65,5.73 43.43,8.51 43.43,13.46 42.87,14.03 | C10.1 13.97,17.14 | J9.1 42.87,14.03 | J8.1 43.25,31.81 44.07,30.99 44.07,22.65 44.31,22.4 44.31,14.85 43.49,14.03 42.87,14.03 | 22.99,4.3 17.25,4.3 16.38,3.43 v14.22,3.43 | v32.26,1.34 28.12,1.34 26.92,2.54 R4.1 | C4.1 15.24,36.2 v15.75,35.69 | D2.A 15.88,35.56 v15.75,35.69 | v15.75,35.69 15.75,34.75 U2.2 14.61,32.05 v14.61,32 v14.61,26.42
  other vias: 1.91,14.26 16.34,14.22
+5V  (via drill 0.35)
  Top 0.152: v24.66,31.16 19.07,31.16 v19.03,31.11 | v0.83,12.95 0.83,11.12 0.66,10.94 0.66,8.28 D1.C 4.42,8.78 4.42,12.76 v4.45,12.78 | v24.26,19.81 26.67,19.81 30.15,23.29 30.15,29.75 v26.92,32.97 26.92,34.67 34.42,42.16 36.2,42.16 | 44.83,29.08 44.83,39.62 44.1,40.35 42.55,40.35 40.73,42.16 36.2,42.16 | 44.83,29.08 42.76,27.02 J11.4 | J12.4 44.29,13.68 44.83,14.22 44.83,29.08 | 36.2,42.16 36.2,35.33 v32.18,31.32
  Top 0.305: v26.92,32.97 25.11,31.16 v24.66,31.16
  Bottom 0.152: v0.83,12.95 0.58,13.21 0.58,47.12 2.87,49.4 9.02,49.4 11.94,46.48 11.94,44.83 13.13,43.64 17.45,43.64 18.67,42.42 18.67,36.99 20.83,34.83 | v4.45,12.78 4.45,16.89 7.37,19.81 v24.26,19.81 | R22.1 32.77,31.5 33.36,30.91 36.53,30.91 R23.1 35.66,30.04 32.96,30.04 31.75,28.83 R24.1 | R22.1 32.4,35.22 IC5.4 | IC5.2 20.83,34.83 | D4.A 20.83,34.83 | v32.18,31.32 31.34,30.48 27.48,30.48 26.92,31.03 v26.92,32.97 | R22.1 37.9,40.35 J10.4 | C7.1 24.55,31.07 24.64,31.16
  Bottom 0.305: D2.K 19.03,35.06 U2.3 v19.03,31.11 19.03,29.61 C8.1 | IC5.4 27.26,32.64 v26.92,32.97 | v24.66,31.16 24.64,31.16 24.5,31.16 IC5.2
  other vias: 42.47,40.35
BUTTON0  (via drill 0.35)
  Top 0.152: SW1.B2 SW1.B1 22.21,27.41 R18.1 21.68,21.16 SW1.B2 | IC1.19 v18.03,10.38 v18.04,10.39 | v21.16,17.27 21.57,17.68 | 21.57,17.68 22.21,18.32 SW1.B2 | 21.57,17.68
  Bottom 0.152: v18.04,10.39 18.04,11.4 17.73,11.71 17.73,13.82 21.16,17.25 v21.16,17.27
BUTTON1  (via drill 0.35)
  Top 0.152: 15.51,20.83 SW2.B2 15.51,27.79 R17.1 16.13,27.47 16.13,21.38 SW2.B1 15.51,20.83 | IC1.18 17.48,8.52 v17.48,11.05 | v15.49,18.72 15.49,20.81 15.51,20.83
  Bottom 0.152: v17.48,11.05 15.49,13.04 v15.49,18.72
D+  (via drill 0.35)
  Top 0.152: v15.88,3.98 15.88,3.73 18.26,1.35 24.13,1.35 25.11,2.33 v25.11,6.86 | IC4.7 6.75,5.9 v6.56,6.09 | v23.78,15.03 23.36,15.45 IC1.36
  Bottom 0.152: J4.P$3 6.35,5.71 6.56,5.92 | 6.56,5.92 6.73,6.09 13.79,6.09 15.88,4.01 v15.88,3.98 | v6.56,6.09 6.56,5.92 | v25.11,6.86 25.66,7.41 25.66,11.68 23.78,13.56 v23.78,15.03
D-  (via drill 0.35)
  Top 0.152: IC4.6 7.63,3.87 v7.63,3.73 | v14.88,3.98 17.82,1.04 24.25,1.04 25.97,2.76 v25.97,6.86 | v25.64,14.23 23.79,14.23 23.07,14.95 IC1.35
  Bottom 0.152: v14.88,3.98 13.08,5.79 7.09,5.79 7,5.7 J4.P$2 7,4.05 7.32,3.73 v7.63,3.73 | v25.97,6.86 25.97,11.62 26.22,11.87 26.22,13.65 v25.64,14.23
GND  (via drill 0.35, 0.7)  (101 unrouted)
  Top 0.152: IC4.8 IC4.11
  other vias: 19.94,27.94 22.86,29.21 20.32,13.08 7.37,15.88 8.38,15.24 5.84,12.7 5.84,11.68 4.06,17.65 9.27,27.81 9.27,32.13 7.75,31.62 7.75,29.59 14.99,42.42 20.57,42.8 20.7,38.99 15.24,38.86 26.04,43.94 30.35,44.58 35.05,7.24 33.4,8.89 26.92,6.86 26.04,1.65 26.92,4.83 20.83,23.5 19.43,25.65 17.53,27.94 6.35,3.3 13.46,1.4 15.11,2.79 16.51,5.71 17.4,5.71 19.56,22.48 24.77,23.5 23.5,20.7 27.18,23.5 18.29,23.5 15.49,11.56 11.3,12.45 9.4,9.27 14.99,6.22 12.57,9.14 2.67,12.45 17.78,3.56 19.56,1.91 20.7,1.91 23.24,6.99 10.03,13.08 9.14,13.08 21.59,6.22 21.97,3.68 20.7,6.22 20.57,3.68 19.68,6.6 33.66,19.94 32.77,25.91
  pour Bottom (isolate 0.254, rank 6, no thermals): -1.14,50.67 -1.14,-1.02 51.94,-1.02 51.94,50.67
  pour Top (isolate 0.254, rank 6, no thermals): -2.79,52.32 -2.79,-2.79 54.61,-2.79 54.61,52.32
LED0
  Top 0.152: LED3.A 14.56,8 IC1.13
LED1
  Top 0.152: LED4.A 8.26,9.66 8.26,7.68 8.56,7.37 15.78,7.37 16.03,7.62 IC1.15
MISO  (via drill 0.35)
  Top 0.152: IC1.46 16.03,17.68 16.48,18.13 v16.97,18.13
  Bottom 0.152: J8.5 39.46,37.81 39.12,37.47 39.12,23.62 40.13,22.61 42.82,22.61 43.4,22.02 43.4,20.41 43.02,20.03 J9.5 37.94,20.03 36.49,18.58 21.33,18.58 21.01,18.9 18.87,18.9 18.11,18.13 v16.97,18.13
MOSI  (via drill 0.35)
  Top 0.152: IC1.45 16.53,16.16 16.47,16.1 16.47,15.21 v16.48,15.2
  Bottom 0.152: v16.48,15.2 16.7,14.99 18.09,14.99 21.07,17.97 37.53,17.97 38.47,17.03 J9.3 43.19,17.03 44.01,17.85 44.01,22.28 43.07,23.22 40.38,23.22 39.73,23.88 39.73,34.67 39.87,34.81 J8.3
N$1  (via drill 0.35)
  Top 0.152: IC1.25 22.43,9.95 v22.61,9.78
  Bottom 0.152: v22.61,9.78 22.61,8.76 21.93,8.09 21.42,8.09 Y1.1 23.57,7.99 C1.1
N$2  (via drill 0.35)
  Top 0.152: v19.43,10.14 19.74,10.45 IC1.26
  Bottom 0.152: v19.43,10.14 19.22,9.93 Y1.3 19.17,9.74 C2.1
N$3
  Bottom 1.27: S2.1 28.49,43.9 D3.A
N$4
  Bottom 0.152: R22.2 32.77,38.35 R25.1
N$5  (via drill 0.35)
  Top 0.305: IC2.6 4.11,27.67 v4.12,27.69
  Bottom 0.305: v4.12,27.69 3.51,28.3 R11.1
N$6
  Top 0.152: 2.41,2.25 IC4.1 IC4.2 5.95,1.76 5.71,1.52 2.41,1.52 2.41,2.25 | 2.41,2.25 D1.A
N$8
  Top 0.152: IC2.14 6.05,17.45 C3.1
N$9
  Bottom 1.27: 22.99,48.22 24.13,47.08 S2.2
  Bottom 2.54: J3.2 18.59,48.22 22.99,48.22
N$10
  Top 0.152: LED1.K 19.14,37.62 R13.1
N$11
  Top 0.305: J1.1 6.71,41.55 IC2.2
N$12
  Top 0.305: J1.2 5.41,40.35 IC2.4
N$13
  Top 0.305: J2.2 4.75,32.12 IC2.5
N$14
  Top 0.305: J2.1 1.14,35.43 1.14,31.75 3.46,29.44 IC2.7
N$15  (via drill 0.35)
  Top 0.305: IC2.3 6.05,27.8 v6.07,27.81
  Bottom 0.305: v6.07,27.81 6.35,28.09 R12.1
N$19  (via drill 0.35)
  Top 0.152: LED3.K 7.5,8.86 R15.1
  other vias: 7.53,8.89
N$20  (via drill 0.35)
  Top 0.152: v6.99,0.83 6.35,1.47 IC4.3
  Bottom 0.152: R19.1 11.85,1.39 11.05,0.58 7.24,0.58 v6.99,0.83
  other vias: 11.85,1.65
N$21  (via drill 0.35)
  Top 0.152: LED4.K 7.41,10.77 R16.1
  other vias: 7.41,11.81
N$22
  Bottom 0.152: R26.1 36.54,29.21 R23.2
N$23  (via drill 0.35)
  Top 0.152: 7.68,5.76 6.79,6.65 6.33,6.65 5.95,6.28 IC4.9 IC4.10 5.42,4.48 5.42,6.44 5.97,6.99 6.99,6.99 7.68,6.29 7.68,5.76 | 7.68,5.76 v7.68,5.24
  Bottom 0.152: J4.P$1 7.65,5.21 v7.68,5.24
N$24
  Top 0.152: R26.2 37.97,26.29 43.87,26.29 44.53,25.63 44.53,23.19 43.85,22.52 J11.1
  Bottom 0.152: R26.3 R26.2
N$25  (via drill 0.35)
  Top 0.152: R27.1 31.75,20.19 R24.2
  other vias: 31.75,20.87
N$26
  Top 0.152: R27.2 37.55,11.47 39.84,9.18 J12.1
  Bottom 0.152: R27.3 R27.2
N$29
  Top 0.152: IC1.28 24.44,11.45 R28.2
N$30  (via drill 0.35)
  Top 0.152: v38.05,27.94 40.01,29.89 40.01,36.32 41.03,37.35 J10.2
  Bottom 0.152: T1.1 33.81,27.94 v38.05,27.94
N$31
  Top 0.152: R25.2 38.91,39.5 44,39.5 44.53,38.97 44.53,36.27 44.07,35.81 42.51,35.81 J10.1
  Bottom 0.152: R25.3 R25.2
N$32  (via drill 0.35)
  Top 0.152: v38.05,24 42.46,24 J11.2
  Bottom 0.152: v38.05,24 36.47,24 T2.1
N$33  (via drill 0.35)
  Bottom 0.152: T3.1 37.59,7.24 41.03,10.68 J12.2
  other vias: 42.47,10.68
PWM_AIN1
  Top 0.152: IC1.1 10.2,15.45 7.36,18.3 IC2.16
PWM_AIN2
  Top 0.152: IC1.2 9.81,14.95 6.71,18.06 IC2.15
PWM_BIN1
  Top 0.152: IC2.9 2.81,15.23 4.08,13.95 IC1.4
PWM_BIN2
  Top 0.152: IC1.3 4.47,14.45 3.46,15.47 IC2.10
SCLK  (via drill 0.35)
  Top 0.152: IC1.44 v17.03,15.87
  Bottom 0.152: v17.03,15.87 17.28,15.62 18.29,15.62 20.95,18.27 36.82,18.27 37.07,18.53 J9.4 43.42,18.53 43.7,18.81 43.7,22.15 42.94,22.91 40.26,22.91 39.42,23.75 39.42,35.87 39.87,36.31 J8.4
SENSOR_EN  (via drill 0.35)
  Top 0.152: v27.81,13.12 R28.1 26.8,11.77 R29.1 33.85,11.77 T3.3 | v29.21,20.19 28.8,19.78 v28.8,15.49
  Bottom 0.152: v27.81,13.12 28.8,14.11 v28.8,15.49 | v29.21,20.19 30.61,21.6 33.52,21.6 | T2.3 35.05,20.07 33.52,21.6 | T1.3 33.52,24.66 33.52,21.6
  other vias: 36.35,9.27
U0RX  (via drill 0.35)
  Top 0.152: IC1.22 19.53,9.45 19.81,9.73 20.9,9.73 21.51,9.12 25.33,9.12 26.29,10.08 26.91,10.08 v27.23,10.39
  Bottom 0.152: v27.23,10.39 27.23,15.8 SV1.2
U0TX  (via drill 0.35)
  Top 0.152: IC1.23 20.03,9.17 20.29,9.43 20.77,9.43 21.39,8.82 25.83,8.82 26.52,9.51 v26.52,9.53
  Bottom 0.152: v26.52,9.53 26.52,14.62 SV1.1
V+  (via drill 0.35)
  Top 0.254: 4.75,20.81 4.21,21.35 3.81,21.35 3.17,21.98 v3.17,24 | v12.19,43.62 22.04,43.62 24.09,41.57 D3.C
  Top 0.508: D3.C 14.1,41.27 7.37,34.54 v7.34,34.54 | v6.71,23.04 6.64,22.96 6.64,21.46 6.4,21.22 5.17,21.22 4.75,20.81 IC2.12
  Bottom 0.152: D4.K 20.95,37.71 | 20.95,37.71 22.9,37.71 23.02,37.59 | C6.1 24.09,39.7 D3.C | C5.1 20.45,40.89 21.34,40.01 21.34,38.09 20.95,37.71
  Bottom 0.254: v3.17,24 3.17,25.95 1.44,27.68 1.44,39.92 5.13,43.62 v12.19,43.62
  Bottom 0.305: D3.C 23.02,40.2 23.02,37.59 IC5.3
  Bottom 0.508: v7.34,34.54 7.34,34.4 5.04,32.11 5.04,27.33 5.08,27.29 5.08,24.67 v6.71,23.04
  other vias: 24.09,41.27
VREF  (via drill 0.35)
  Top 0.152: v8.46,26.11 8.46,25.61 7.67,24.83 2.79,24.83 2.41,24.45 2.41,21.84 3.37,20.89 3.77,20.89 4.11,20.56 IC2.11 | v3.76,41.1 0.58,37.92 0.58,14.21 1.45,13.34 8,13.34 10.39,10.95 IC1.10 14.7,10.95 15.53,10.12 IC1.14
  Bottom 0.152: v8.46,26.11 8.46,36.14 11.26,38.95 R10.2 | v3.76,41.1 3.94,41.27 10.38,41.27 | 10.38,41.27 R10.2 | R10.2 12.7,42.44 U1.1 11.06,43.06 10.38,42.38 10.38,41.27